# Altium schematic sheet 990308_Schematic.SchDoc
size A
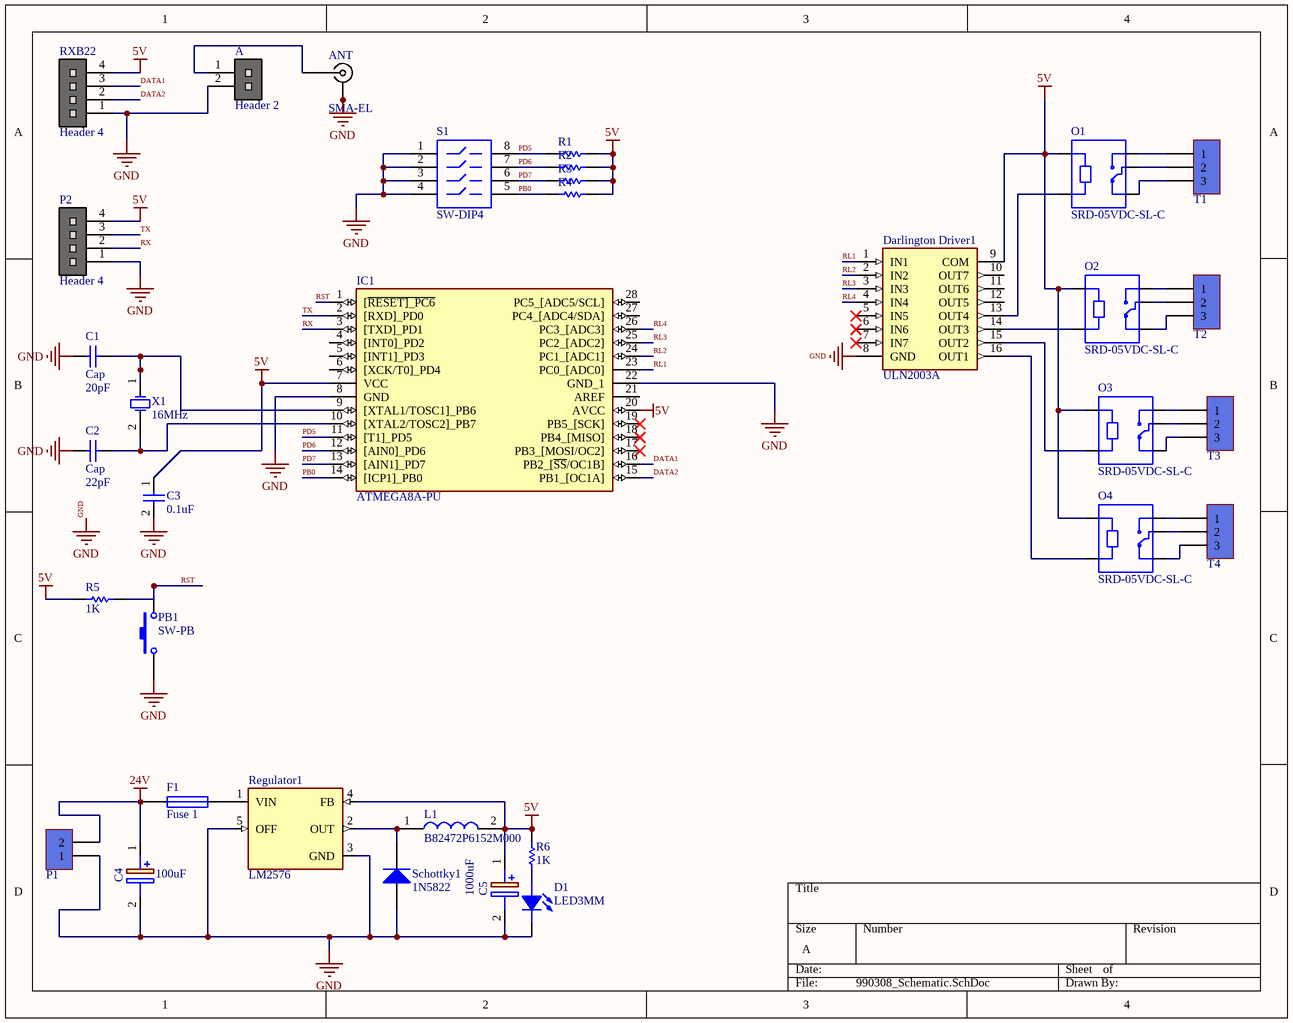
[diagram p0: 990308_Schematic.SchDoc]

## Parts
A  Header 2  [HDR 1X2]
ANT  SMA-EL  [SMA-ENDLAUNCH]
C1  Cap  value 20pF  [RAD-0.3]
C2  Cap  value 22pF  [RAD-0.3]
C3  0.1uF  [RAD-0.3]
C4  100uF  [CAPPRD550W60D1050H2150]
C5  1000uF  [CAPPRD550W60D1050H2150]
D1  LED3MM  [LED3mm_GRN]
Darlington_Driver1  ULN2003A  [DIP794W56P254L1918H533Q16N]
F1  Fuse 1  [PIN-W2/E2.8]
IC1  ATMEGA8A-PU  [DIP794W53P254L3467H457Q28N]
L1  B82472P6152M000  [INDPM7474X450N]
O1  SRD-05VDC-SL-C  [RELAY_SRD-05VDC-SL-C]
O2  SRD-05VDC-SL-C  [RELAY_SRD-05VDC-SL-C]
O3  SRD-05VDC-SL-C  [RELAY_SRD-05VDC-SL-C]
O4  SRD-05VDC-SL-C  [RELAY_SRD-05VDC-SL-C]
P1  KF301_Terminal  [KF301 2PIN]  (value not drawn)
P2  Header 4  [HDR 1X4]
PB1  SW-PB  [SPST-2]
R1  1K  [Axial 0_25w_2_54mm]  (value not drawn)
R2  1K  [Axial 0_25w_2_54mm]  (value not drawn)
R3  1K  [Axial 0_25w_2_54mm]  (value not drawn)
R4  1K  [Axial 0_25w_2_54mm]  (value not drawn)
R5  1K  [Axial 0_25w_2_54mm]
R6  1K  [Axial 0_25w_2_54mm]
Regulator1  LM2576  [TO220-5]
RXB22  Header 4  [HDR 1X4]
S1  SW-DIP4  [DIP-8]
Schottky1  1N5822  [DO-41]
T1  KF301_Terminal  [KF301 3PIN]  (value not drawn)
T2  KF301_Terminal  [KF301 3PIN]  (value not drawn)
T3  KF301_Terminal  [KF301 3PIN]  (value not drawn)
T4  KF301_Terminal  [KF301 3PIN]  (value not drawn)
X1  16MHz  [XTAL Small]

## Nets
5V: C3.1 C5.1(+) Darlington_Driver1.9(COM) IC1.7(VCC) IC1.20(AVCC) L1.2 O1.A1 O2.A1 O3.A1 O4.A1 P2.4 R1.2 R2.1 R3.1 R4.1 R5.2 R6.1 Regulator1.4(FB) RXB22.4
24V: C4.1(+) F1.1 P1.2
GND: A.2 ANT.2 ANT.3 ANT.4 ANT.5 C1.1 C2.1 C3.2 C4.2(-) C5.2(-) D1.2(CATHODE) Darlington_Driver1.8(GND) IC1.8(GND) IC1.22(GND_1) P1.1 P2.1 PB1.1 Regulator1.3(GND) Regulator1.5(OFF) RXB22.1 S1.1 S1.2 S1.3 S1.4 Schottky1.1(A)
DATA1: IC1.16(PB2_[~{SS}/OC1B]) RXB22.3
DATA2: IC1.15(PB1_[OC1A]) RXB22.2
PB0: IC1.14([ICP1]_PB0) R4.2 S1.5
PD5: IC1.11([T1]_PD5) R1.1 S1.8
PD6: IC1.12([AIN0]_PD6) R2.2 S1.7
PD7: IC1.13([AIN1]_PD7) R3.2 S1.6
RL1: Darlington_Driver1.1(IN1) IC1.23(PC0_[ADC0])
RL2: Darlington_Driver1.2(IN2) IC1.24(PC1_[ADC1])
RL3: Darlington_Driver1.3(IN3) IC1.25(PC2_[ADC2])
RL4: Darlington_Driver1.4(IN4) IC1.26(PC3_[ADC3])
RST: IC1.1([~{RESET]_PC6}) PB1.2 R5.1
RX: IC1.3([TXD]_PD1) P2.2
TX: IC1.2([RXD]_PD0) P2.3
NetA_1: A.1 ANT.1
NetC1_2: C1.2 IC1.9([XTAL1/TOSC1]_PB6) X1.1(OSC1)
NetC2_2: C2.2 IC1.10([XTAL2/TOSC2]_PB7) X1.2(OSC2)
NetD1_1: D1.1(ANODE) R6.2
NetDarlington_Driver1_13: Darlington_Driver1.13(OUT4) O1.A2
NetDarlington_Driver1_14: Darlington_Driver1.14(OUT3) O2.A2
NetDarlington_Driver1_15: Darlington_Driver1.15(OUT2) O3.A2
NetDarlington_Driver1_16: Darlington_Driver1.16(OUT1) O4.A2
NetF1_2: F1.2 Regulator1.1(VIN)
NetL1_1: L1.1 Regulator1.2(OUT) Schottky1.2(K)
NetO1_COM: O1.COM T1.2
NetO1_NC: O1.NC T1.3
NetO1_NO: O1.NO T1.1
NetO2_COM: O2.COM T2.2
NetO2_NC: O2.NC T2.3
NetO2_NO: O2.NO T2.1
NetO3_COM: O3.COM T3.2
NetO3_NC: O3.NC T3.3
NetO3_NO: O3.NO T3.1
NetO4_COM: O4.COM T4.2
NetO4_NC: O4.NC T4.3
NetO4_NO: O4.NO T4.1

Not connected (* = marked no-connect by the designer): Darlington_Driver1 5(IN5)* 6(IN6)* 7(IN7)* 10(OUT7) 11(OUT6) 12(OUT5); IC1 4([INT0]_PD2) 5([INT1]_PD3) 6([XCK/T0]_PD4) 17(PB3_[MOSI/OC2])* 18(PB4_[MISO])* 19(PB5_[SCK])* 21(AREF) 27(PC4_[ADC4/SDA]) 28(PC5_[ADC5/SCL])

## Library data of the parts
A = Header 2: Header, 2-Pin
ANT = SMA-EL: SMA THREADED RF CONNECTOR VERTICAL
C1-C3 = Cap: Capacitor; Published: 8-Jun-2000; LatestRevisionDate: 17-Jul-2002; LatestRevisionNote: Re-released for DXP Platform.; PackageReference: RAD-0.3; Publisher: Altium Limited; PackageDescription: Radial Cap, Thru-Hole; 2 Leads; 0.3 in Pin Spacing
C4 C5 = 108CKE025M: Capacitor Polarised; Manufacturer_Name: Cinch; Datasheet Link: https://componentsearchengine.com/Datasheets/2/108CKE025M.pdf; Height: 21.5mm; Manufacturer_Part_Number: 108CKE025M
D1 = LED 3MM: Light Emitting Diode; Designer: Ali Hafizi
Darlington_Driver1 = ULN2003A: Integrated Circuit; Manufacturer_Name: STMicroelectronics; Allied_Number: 70014189; Datasheet Link: http://www.st.com/web/en/resource/technical/document/datasheet/CD00001244.pdf; Height: 5.33mm; Manufacturer_Part_Number: ULN2003A; Mouser Part Number: 511-ULN2003A; Mouser Price/Stock: https://www.mouser.com/Search/Refine.aspx?Keyword=511-ULN2003A; RS Part Number: 6868209; RS Price/Stock: http://uk.rs-online.com/web/p/products/6868209; Allied Price/Stock: http://www.alliedelec.com/stmicroelectronics-uln2003a/70014189/
F1 = Fuse 1: Fuse; Published: 8-Jun-2000; LatestRevisionDate: 17-Jul-2002; LatestRevisionNote: Re-released for DXP Platform.; PackageReference: PIN-W2/E2.8; Publisher: Altium Limited; PackageDescription: Thru-Hole; 2 Leads
IC1 = ATMEGA8A-PU: Integrated Circuit; Manufacturer_Name: Microchip; Datasheet Link: http://www.atmel.com/images/atmel-8159-8-bit-avr-microcontroller-atmega8a_summary.pdf; Height: 4.572mm; Manufacturer_Part_Number: ATMEGA8A-PU; Mouser Part Number: 556-ATMEGA8A-PU; Mouser Price/Stock: https://www.mouser.com/Search/Refine.aspx?Keyword=556-ATMEGA8A-PU; RS Part Number: 1310372P; RS Price/Stock: http://uk.rs-online.com/web/p/products/1310372P
L1 = B82472P6152M000: Inductor; Manufacturer_Name: EPCOS; Datasheet Link: https://www.tdk-electronics.tdk.com/inf/30/db/ind_2008/b82472p6.pdf; Height: 4.5mm; Manufacturer_Part_Number: B82472P6152M000; Mouser Part Number: 871-B82472P6152M000; Mouser Price/Stock: https://www.mouser.com/Search/Refine.aspx?Keyword=871-B82472P6152M000
O1-O4 = SRD-05VDC-SL-C: 5V Trigger Relay Module For Arduino And Raspberry Pi 5V Trigger Relay Module For Arduino And Raspberry Pi; MF: Songle Relay; Package: None; Availability: Unavailable; Value: *; MP: SRD-05VDC-SL-C; SnapEDA_Link: https://www.snapeda.com/parts/SRD-05VDC-SL-C/Songle%20Relay/view-part/1029484/?ref=snap; Price: None
P1 = KF301-2Pin_Terminal: Terminal 2 Pin 250VAC 16A; Part. No: KF301 2P; Designer: Abbas Basereh; Link: https://www.aliexpress.com/item/
P2 RXB22 = Header 4: Header, 4-Pin
PB1 = SW-PB: Switch; Published: 24-Mar-1999; LatestRevisionDate: 17-Jul-2002; LatestRevisionNote: Re-released for DXP Platform.; PackageReference: SPST-2; Publisher: Altium Limited; PackageDescription: Switch; 2 Leads
R1-R6 = RES Axial 0.25W: Designer: Abbas Basereh; Desc.: RES Axial 0.25W; Data: 4-1-2017
Regulator1 = LM2576: Buck Switching Regulator IC Positive Fixed 5V 1 Output 3A TO-263-6, DÂ²Pak _5 Leads + Tab_, TO-263BA; MF: Texas Instruments; Price: None; Package: TO-263-6 National Semiconductor; Value: *; MP: LM2576; Availability: Unavailable; SnapEDA_Link: https://www.snapeda.com/parts/LM2576/Texas%20Instruments/view-part/214937/?ref=snap
S1 = SW-DIP4: DIP Switch; Published: 24-Mar-1999; LatestRevisionDate: 17-Jul-2002; LatestRevisionNote: Re-released for DXP Platform.; PackageReference: DIP-8; Publisher: Altium Limited
Schottky1 = Diode 1N4001: 1 Amp General Purpose Rectifier; Published: 8-Jun-2000; LatestRevisionDate: 17-Jul-2002; LatestRevisionNote: Re-released for DXP Platform.; DatasheetVersion: 1998; PackageVersion: Aug-1999; PackageReference: DO-41; Publisher: Altium Limited; PackageDescription: Diode, Axial; Body 5.2 x 2.7 mm (LxDia. max), Lead Dia. 0.86 mm (max); Code_JEDEC: DO-204-AL; ComponentLink1Description: Manufacturer Link; ComponentLink1URL: http://www.fairchildsemi.com/; ComponentLink2Description: Datasheet; ComponentLink2URL: http://www.fairchildsemi.com/ds/1N%2F1N4001.pdf
T1-T4 = KF301-3Pin_Terminal: Terminal 3 Pin 250VAC 16A; Part. No: KF301 3P; Designer: Abbas Basereh; Link: https://www.aliexpress.com/item/
X1 = XTAL: XTAL Crystal; Company: E.P.I.L; Design Date: 11/04/2011; Value: 16MHz